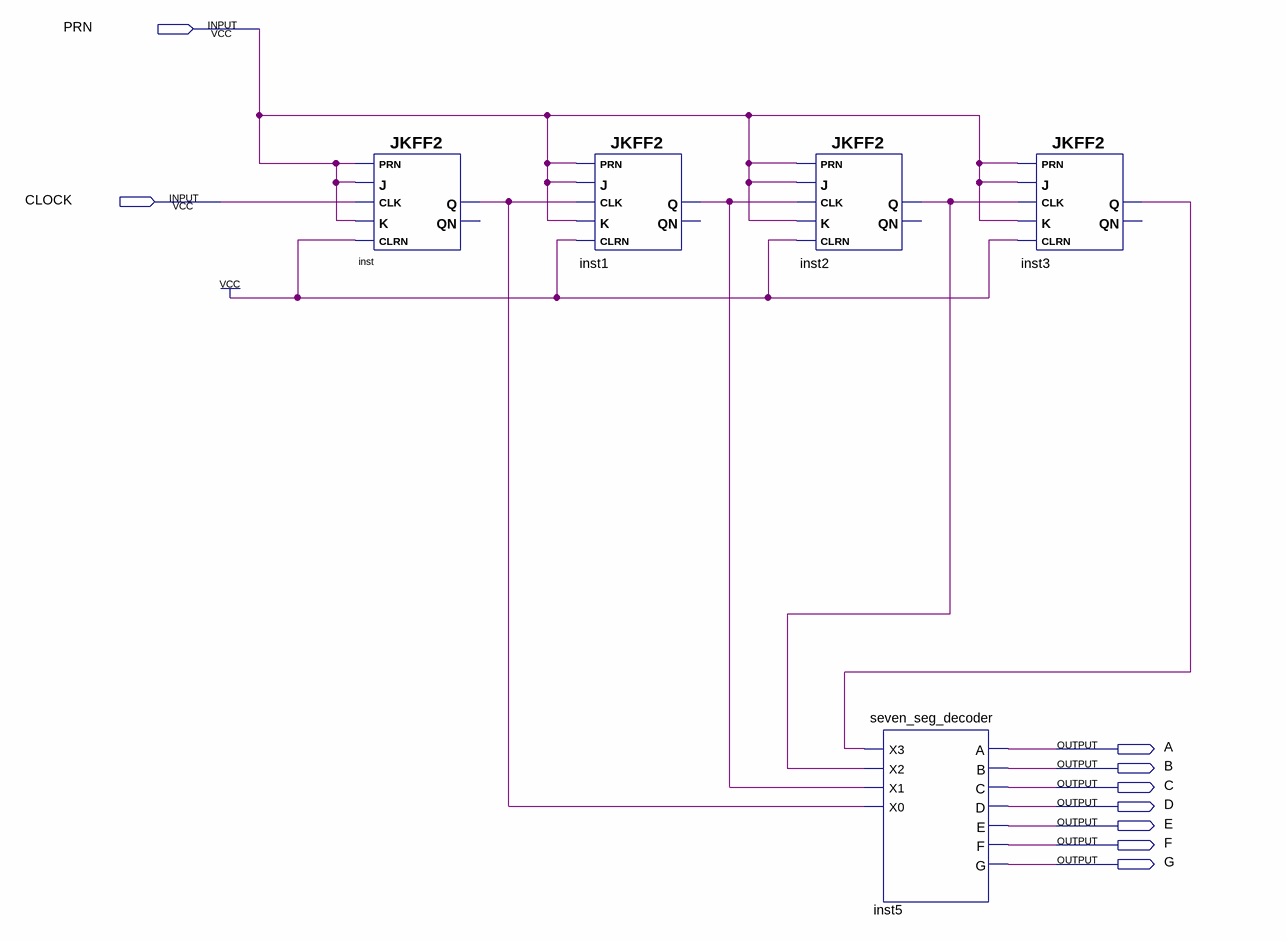
[diagram p0: schematic sheet]
// Quartus schematic lab10step3b.bdf as structural Verilog: 5 symbols, 9 pins
module lab10step3b (
  input  PRN,
  input  CLOCK,
  output A,
  output B,
  output C,
  output D,
  output E,
  output F,
  output G
);

  wire inst1_q, inst2_q, inst3_q, inst_q;

  JKFF2 inst (.K(PRN), .CLRN(1'b1), .CLK(CLOCK), .PRN(PRN), .J(PRN), .Q(inst_q));  // open: QN
  JKFF2 inst1 (.K(PRN), .CLRN(1'b1), .CLK(inst_q), .PRN(PRN), .J(PRN), .Q(inst1_q));  // open: QN
  JKFF2 inst2 (.K(PRN), .CLRN(1'b1), .CLK(inst1_q), .PRN(PRN), .J(PRN), .Q(inst2_q));  // open: QN
  seven_seg_decoder inst5 (
    .X3(inst3_q), .X2(inst2_q), .X1(inst1_q), .X0(inst_q), .A(A), .B(B), .C(C), .D(D), .E(E), .F(F), .G(G));
  JKFF2 inst3 (.K(PRN), .CLRN(1'b1), .CLK(inst2_q), .PRN(PRN), .J(PRN), .Q(inst3_q));  // open: QN
endmodule
